# EAGLE design RasPi-BplusHAT (EAGLE 7.3.0)
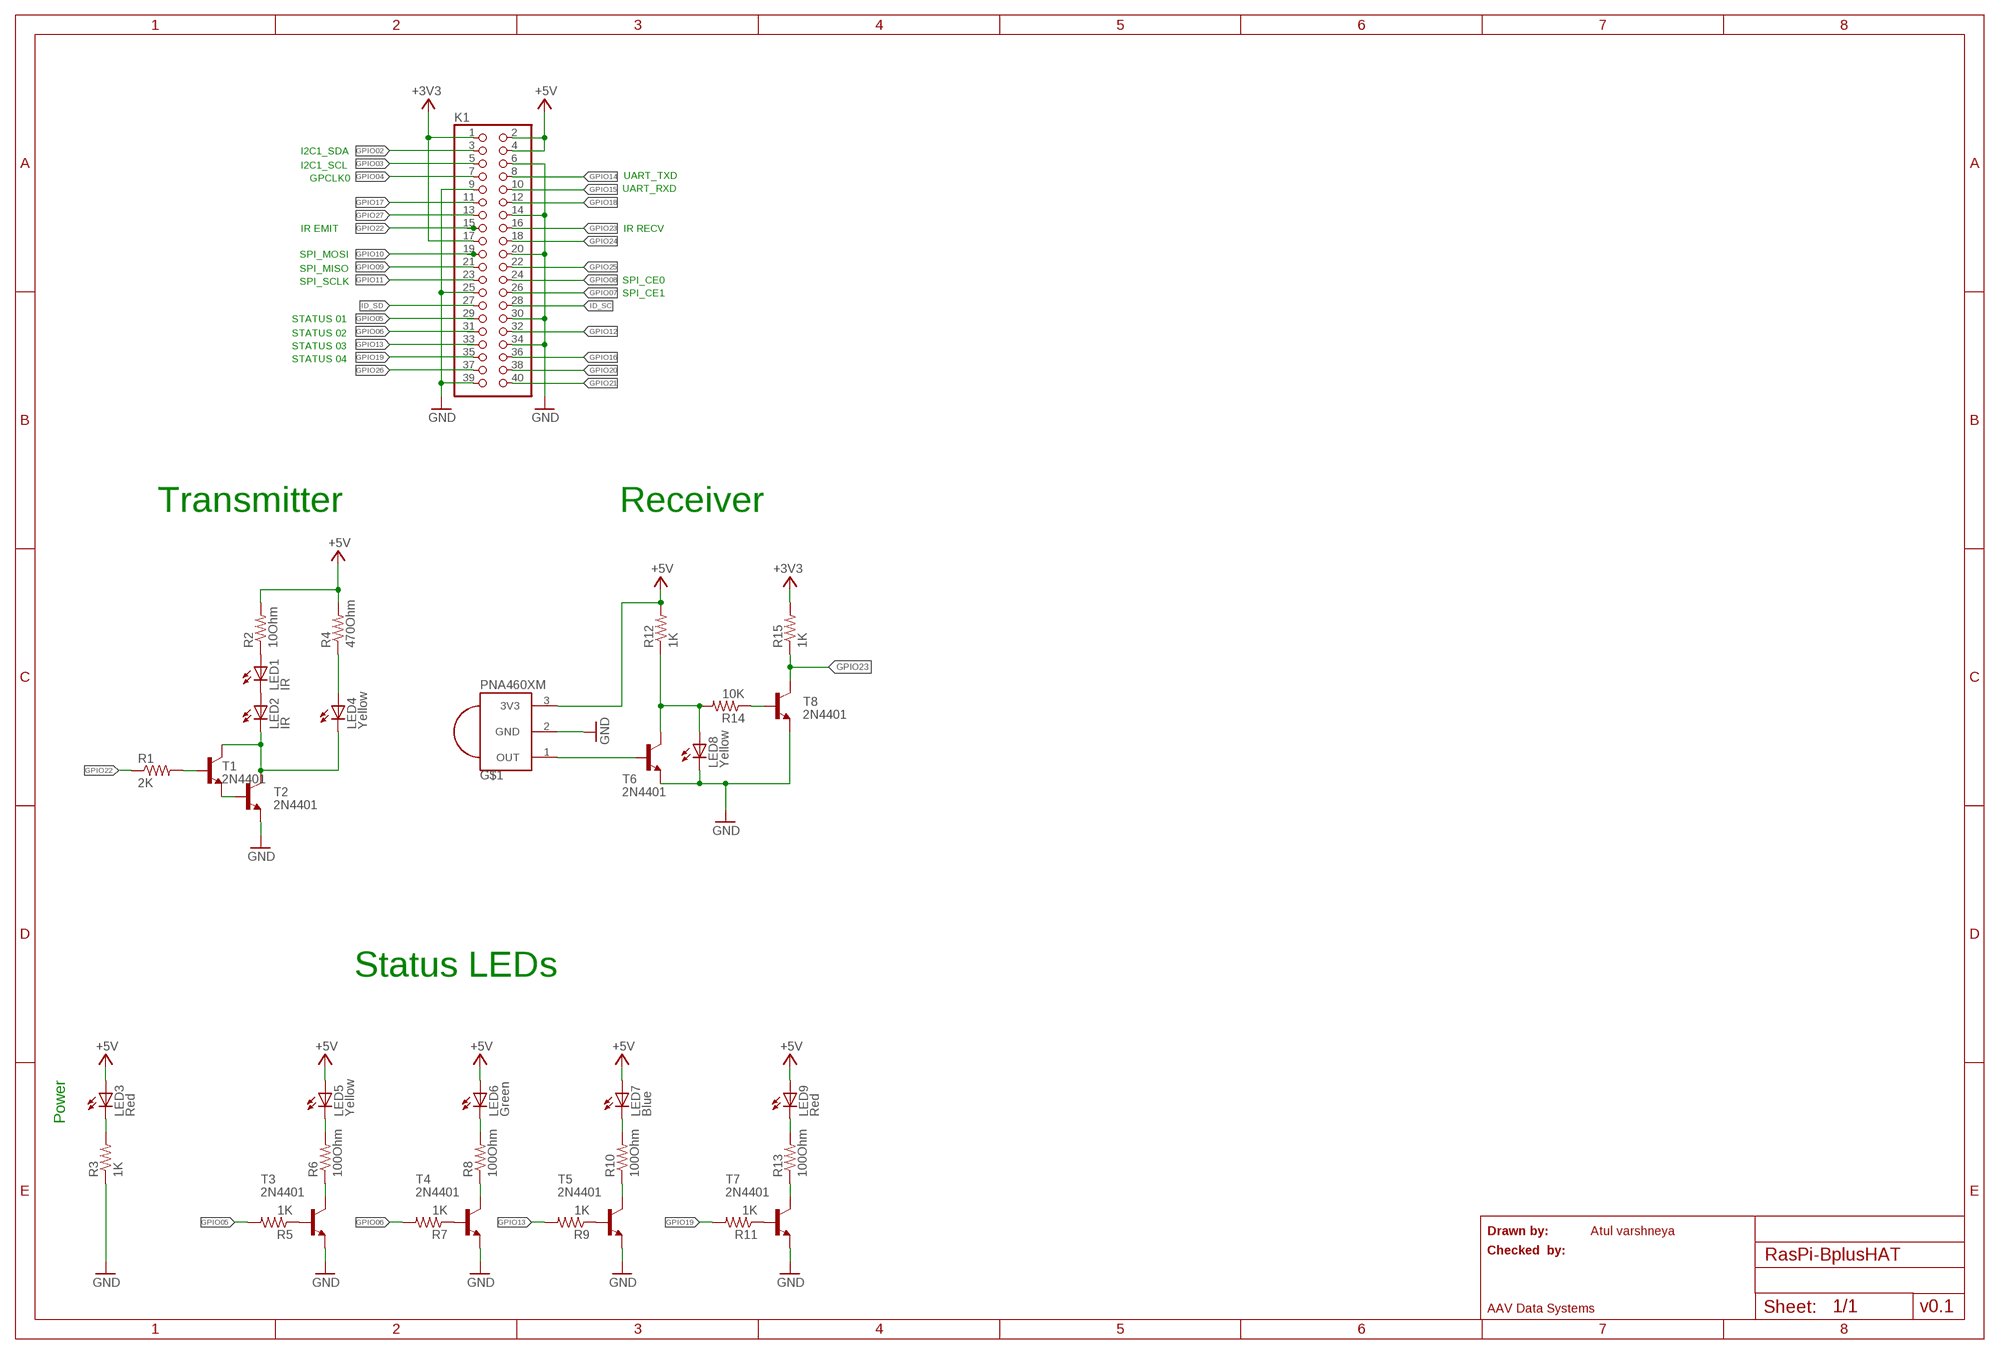
[diagram p0: schematic, sheet 1]

## Parts
G$1  PNA460XM  [PNA460XM]
K1  PINHD-2X20  [2X20]
LED1  IR  LEDMICRO-SIDELED  [MICRO-SIDELED]
LED2  IR  LEDMICRO-SIDELED  [MICRO-SIDELED]
LED3  Red  LEDCHIPLED_0805  [CHIPLED_0805]
LED4  Yellow  LEDCHIPLED_0805  [CHIPLED_0805]
LED5  Yellow  LEDCHIPLED_0805  [CHIPLED_0805]
LED6  Green  LEDCHIPLED_0805  [CHIPLED_0805]
LED7  Blue  LEDCHIPLED_0805  [CHIPLED_0805]
LED8  Yellow  LEDCHIPLED_0805  [CHIPLED_0805]
LED9  Red  LEDCHIPLED_0805  [CHIPLED_0805]
R1  2K  R-US_R0805  [R0805]
R2  10Ohm  R-US_R0805  [R0805]
R3  1K  R-US_R0805  [R0805]
R4  470Ohm  R-US_R0805  [R0805]
R5  1K  R-US_R0805  [R0805]
R6  100Ohm  R-US_R0805  [R0805]
R7  1K  R-US_R0805  [R0805]
R8  100Ohm  R-US_R0805  [R0805]
R9  1K  R-US_R0805  [R0805]
R10  100Ohm  R-US_R0805  [R0805]
R11  1K  R-US_R0805  [R0805]
R12  1K  R-US_R0805  [R0805]
R13  100Ohm  R-US_R0805  [R0805]
R14  10K  R-US_R0805  [R0805]
R15  1K  R-US_R0805  [R0805]
T1  2N4401  MMBT4401LT1-NPN-SOT23-BEC  [SOT23-BEC]
T2  2N4401  MMBT4401LT1-NPN-SOT23-BEC  [SOT23-BEC]
T3  2N4401  MMBT4401LT1-NPN-SOT23-BEC  [SOT23-BEC]
T4  2N4401  MMBT4401LT1-NPN-SOT23-BEC  [SOT23-BEC]
T5  2N4401  MMBT4401LT1-NPN-SOT23-BEC  [SOT23-BEC]
T6  2N4401  MMBT4401LT1-NPN-SOT23-BEC  [SOT23-BEC]
T7  2N4401  MMBT4401LT1-NPN-SOT23-BEC  [SOT23-BEC]
T8  2N4401  MMBT4401LT1-NPN-SOT23-BEC  [SOT23-BEC]

## Nets
+3V3: K1.1 K1.17 R15.2
+5V: G$1.3(3V3) K1.2 K1.4 LED3.A LED5.A LED6.A LED7.A LED9.A R2.2 R4.2 R12.2
GND: G$1.2(GND) K1.6 K1.9 K1.14 K1.20 K1.25 K1.30 K1.34 K1.39 LED8.C R3.1 T2.E T3.E T4.E T5.E T6.E T7.E T8.E
GPIO02: K1.3
GPIO03: K1.5
GPIO04: K1.7
GPIO05: K1.29 R5.2
GPIO06: K1.31 R7.2
GPIO07: K1.26
GPIO08: K1.24
GPIO09: K1.21
GPIO10: K1.19
GPIO11: K1.23
GPIO12: K1.32
GPIO13: K1.33 R9.2
GPIO14: K1.8
GPIO15: K1.10
GPIO16: K1.36
GPIO17: K1.11
GPIO18: K1.12
GPIO19: K1.35 R11.2
GPIO20: K1.38
GPIO21: K1.40
GPIO22: K1.15 R1.1
GPIO23: K1.16 R15.1 T8.C
GPIO24: K1.18
GPIO25: K1.22
GPIO26: K1.37
GPIO27: K1.13
ID_SC: K1.28
ID_SD: K1.27
N$1: R6.1 T3.C
N$2: LED1.A R2.1
N$3: LED1.C LED2.A
N$4: LED2.C LED4.C T1.C T2.C
N$5: R1.2 T1.B
N$6: LED4.A R4.1
N$7: LED5.C R6.2
N$8: G$1.1(OUT) T6.B
N$9: R5.1 T3.B
N$10: LED8.A R12.1 R14.2 T6.C
N$11: T1.E T2.B
N$12: R8.1 T4.C
N$13: R10.1 T5.C
N$14: LED9.C R13.2
N$15: R13.1 T7.C
N$16: LED7.C R10.2
N$17: LED6.C R8.2
N$18: R7.1 T4.B
N$19: R9.1 T5.B
N$20: R11.1 T7.B
N$21: LED3.C R3.2
N$23: R14.1 T8.B

## Notes on the sheet
- I2C1_SDA
- I2C1_SCL
- GPCLK0 | UART_TXD
- UART_RXD
- IR EMIT | IR RECV
- SPI_MOSI
- SPI_MISO
- SPI_SCLK | SPI_CE0
- SPI_CE1
- STATUS 01
- STATUS 02
- STATUS 03
- STATUS 04
- Receiver
- Transmitter
- Status LEDs
- Power
- Drawn by: | Atul varshneya
- Checked  by:
- AAV Data Systems | v0.1

## Library data of the parts
G$1 = adafruit:PNA460XM: IR 38KHz receiver PNA4602 and related receivers http://www.ladyada.net/library/pcb/eaglelibrary.html; MPN: TSDP34138; OC_NEWARK: 68X1938
K1 = adafruit:PINHD-2X20: PIN HEADER; OC_NEWARK: unknown
LED1 LED2 = led:LED: LED; MPN: VSMB10940X01; OC_NEWARK: 64X9433
LED3 LED9 = adafruit:LED: LED; MPN: 150080RS75000; OC_NEWARK: 95W3801
LED4 LED5 LED8 = adafruit:LED: LED; MPN: 150080YS75000; OC_NEWARK: 95W3804
LED6 = adafruit:LED: LED; MPN: 150080GS75000; OC_NEWARK: 95W3800
LED7 = adafruit:LED: LED; MPN: 150080BS75000; OC_NEWARK: 95W3799
R1 = adafruit:R-US_: RESISTOR, American symbol; MPN: CRCW08052K00JNEA; OC_NEWARK: 59M6864
R2 = adafruit:R-US_: RESISTOR, American symbol; MF: OUTSOURCE ITEM; MPN: RP2012S-100-F; OC_NEWARK: 28K1497
R3 R5 R7 R9 R11 R12 R15 = rcl:R-US_: RESISTOR, American symbol; MF: VISHAY/DALE; MPN: CRCW08051K00JNEA; OC_NEWARK: 52K9725
R4 = adafruit:R-US_: RESISTOR, American symbol; MPN: CRCW0805470RJNEA; OC_NEWARK: 59M8584
R6 R8 R10 R13 = rcl:R-US_: RESISTOR, American symbol; MPN: CRCW0805100RJNTA; OC_NEWARK: 57K6355
R14 = rcl:R-US_: RESISTOR, American symbol; MF: VISHAY/DALE; MPN: CRCW080510K0JNEB; OC_NEWARK: 65J1362
T1 T2 = transistor-neu-to92:*-NPN-: NPN Transistror BF959 corrected 2008.03.06; MPN: MMBT4401-TP; OC_NEWARK: 51T4931
T3-T8 = transistor:*-NPN-: NPN Transistror BF959 corrected 2008.03.06; MPN: MMBT4401-TP; OC_NEWARK: 51T4931

## Board
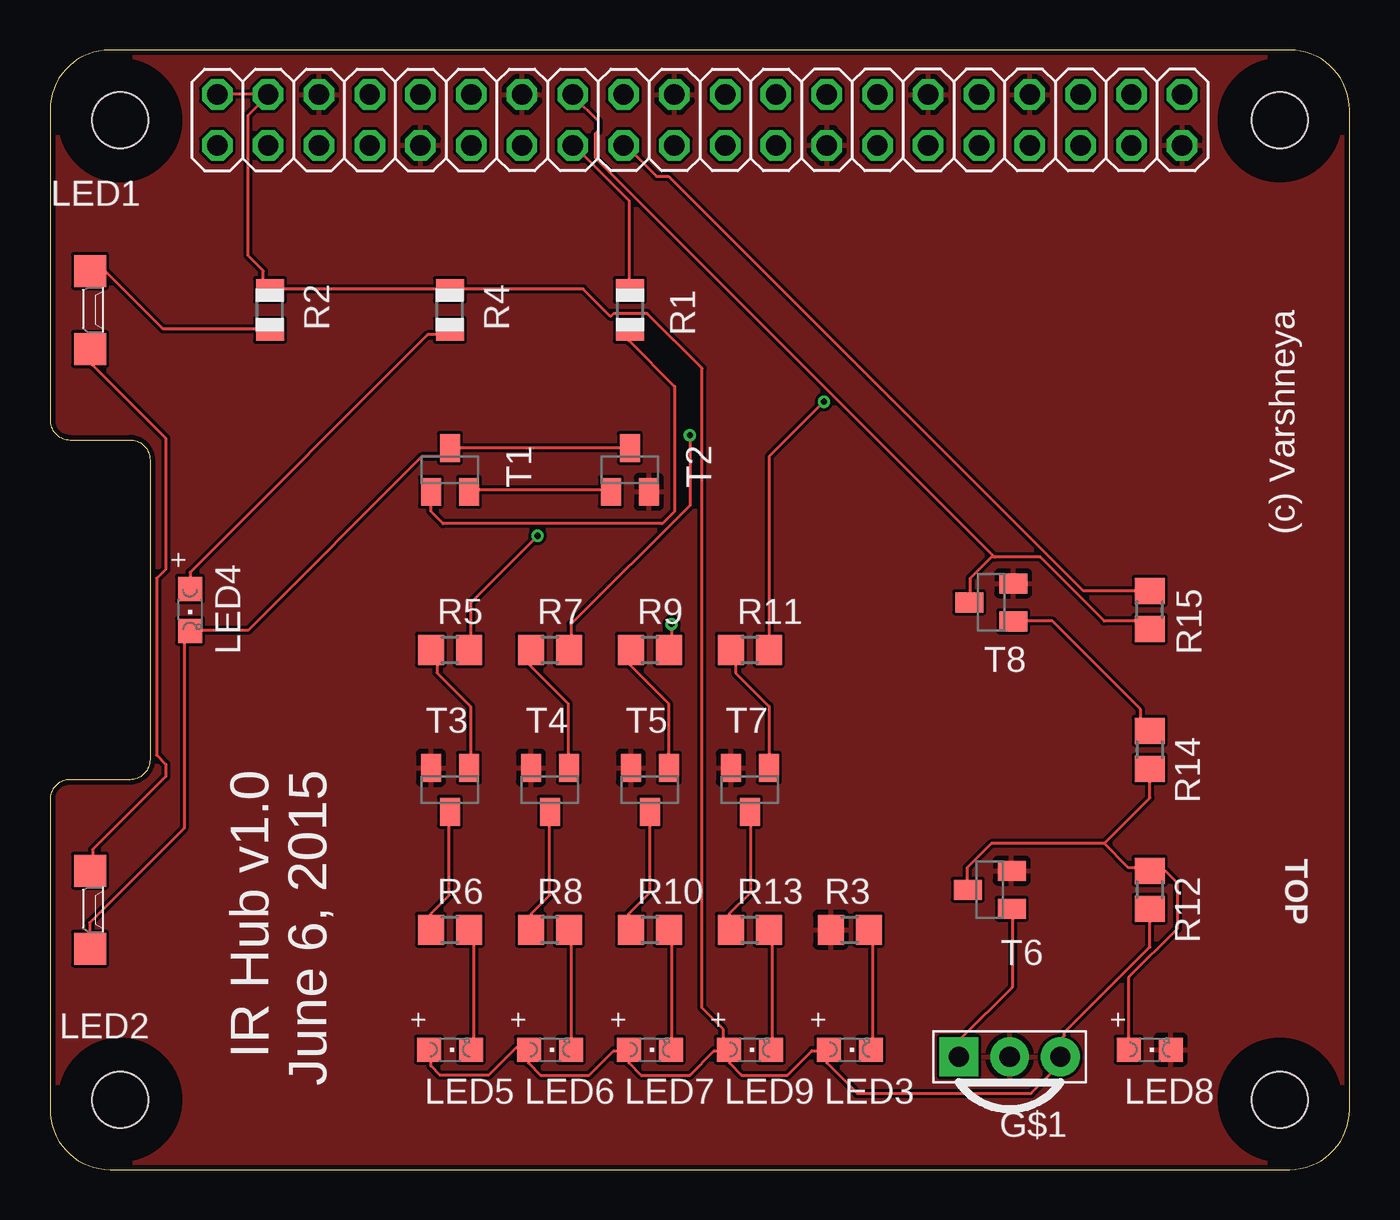
[diagram p1: board, top side]
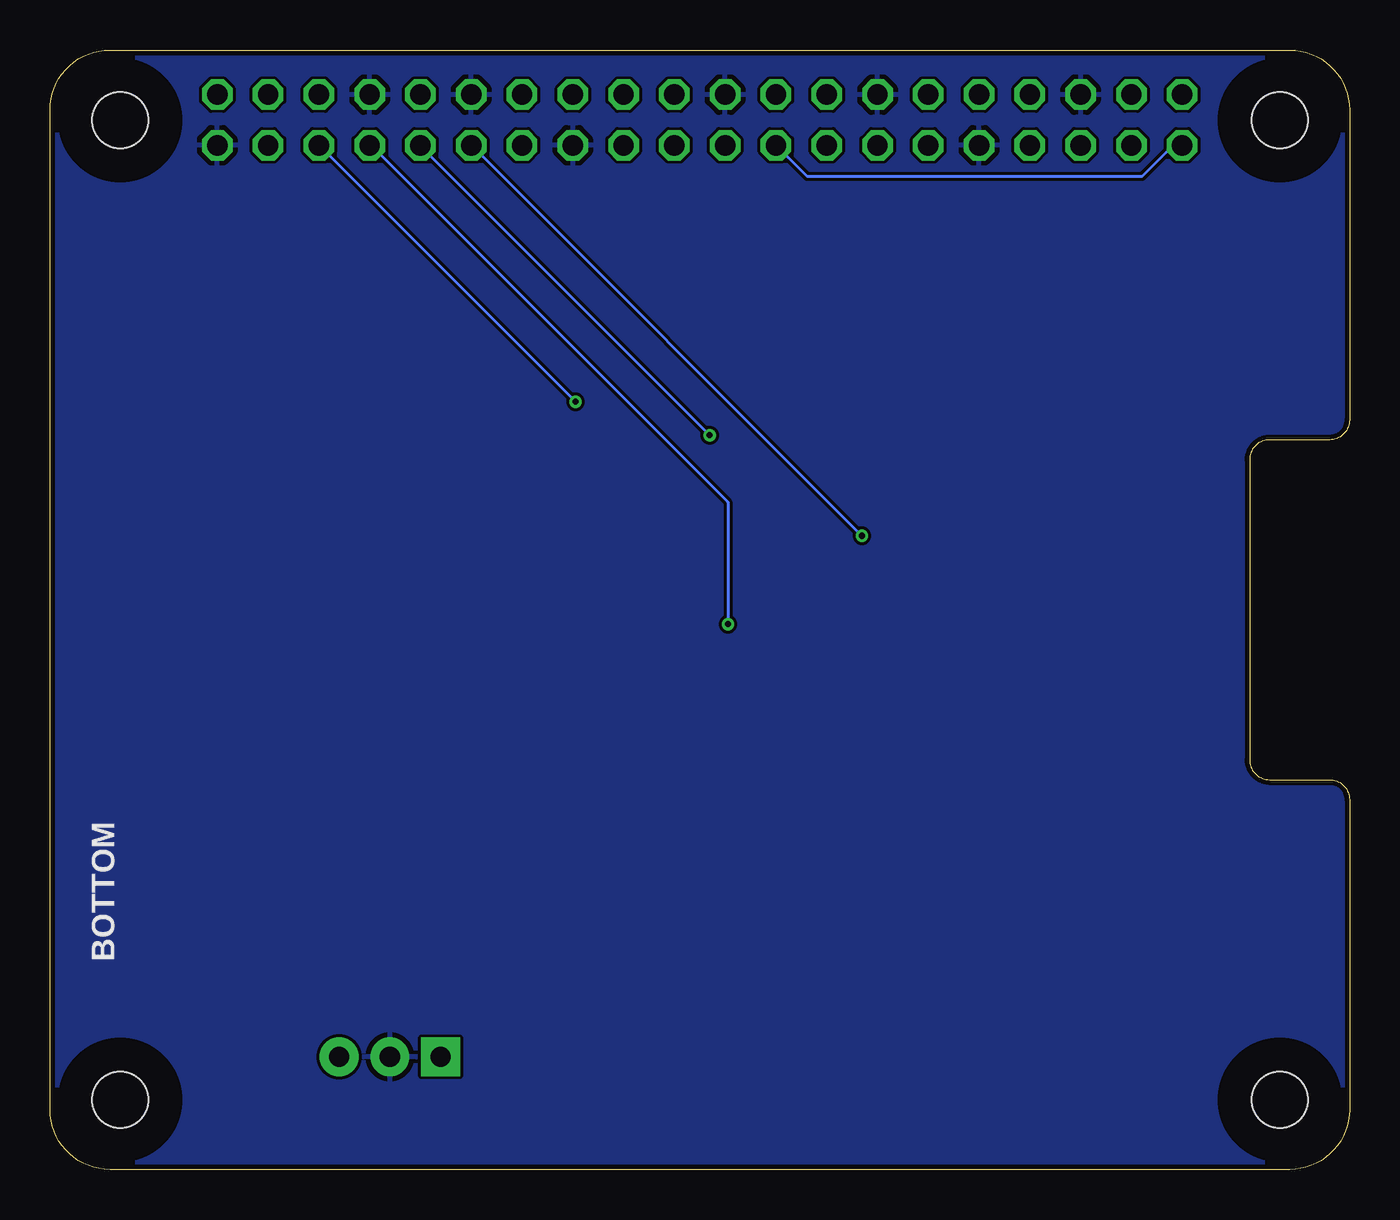
[diagram p2: board, bottom side, seen from below]

Size 65 x 56 mm. Coordinates in mm from the lower left corner, seen from the top.
Outline: 0,3 arc90 3,0 62,0 arc90 65,3 65,53 arc90 62,56 3,56 arc90 0,53 0,37.5 arc90 1,36.5 4,36.5 arc-90 5,35.5 5,20.5 arc-90 4,19.5 1,19.5 arc90 0,18.5 0,3
Copper layers (1*16): Top 0.035mm / dielectric 1.5mm / Bottom 0.035mm
Design rules "ITEADstudio_DRC": minimum track width 6mil, minimum drill 12mil, track to track 6mil, track to pad 6mil, pad to pad 6mil, via to via 6mil, smd to smd 0mil, copper to edge 10mil, drill to drill 10mil, minimum pad ring 10mil, minimum via ring 6mil, stop-mask expansion 2mil, vias tented up to drill 100mil, thermal gap 10mil
Holes 2.8 mm at 3.5,3.5 3.5,52.5 61.5,52.5 61.5,3.5
tRestrict: area 1.9,51 to 5,54; area 60,51 to 63,54; area 60,1.9 to 63,5; area 1.9,1.9 to 5,5
bRestrict: area 1.9,1.9 to 5,5; area 1.9,51 to 5,54; area 60,1.9 to 63,5; area 60,51 to 63,54

### Footprints (pad centres in the part's own frame; a part is rotated, then mirrored left to right if it is on the bottom)
PNA460XM = drill 1.016 pad 1.93 square: 1 -2.54,0 | drill 1.016 pad 1.93: 2 0,0; 3 2.54,0
2X20 = drill 1.016 octagon: 1 -24.13,-1.27; 2 -24.13,1.27; 3 -21.59,-1.27; 4 -21.59,1.27; 5 -19.05,-1.27; 6 -19.05,1.27; 7 -16.51,-1.27; 8 -16.51,1.27; 9 -13.97,-1.27; 10 -13.97,1.27; 11 -11.43,-1.27; 12 -11.43,1.27; 13 -8.89,-1.27; 14 -8.89,1.27; 15 -6.35,-1.27; 16 -6.35,1.27; 17 -3.81,-1.27; 18 -3.81,1.27; 19 -1.27,-1.27; 20 -1.27,1.27; 21 1.27,-1.27; 22 1.27,1.27; 23 3.81,-1.27; 24 3.81,1.27; 25 6.35,-1.27; 26 6.35,1.27; 27 8.89,-1.27; 28 8.89,1.27; 29 11.43,-1.27; 30 11.43,1.27; 31 13.97,-1.27; 32 13.97,1.27; 33 16.51,-1.27; 34 16.51,1.27; 35 19.05,-1.27; 36 19.05,1.27; 37 21.59,-1.27; 38 21.59,1.27; 39 24.13,-1.27; 40 24.13,1.27
MICRO-SIDELED = smd 1.6 x 1.6: A 0,1.95; C 0,-1.95
CHIPLED_0805 = smd 1.2 x 1.2: A 0,-1.05; C 0,1.05
R0805 = smd 1.1 x 1.4: 1 -1,0; 2 1,0
R0805' = smd 1.3 x 1.5: 1 -0.95,0; 2 0.95,0
SOT23-BEC = smd 1 x 1.4: B -0.95,-1.1; C 0,1.1; E 0.95,-1.1

### Placement (x,y rotation side)
G$1  48,5.63 0 top
K1  32.5,52.5 0 top
LED1  2,43 0 top
LED2  2,13 0 top
LED3  40,6 270 top
LED4  7,28 180 top
LED5  20,6 270 top
LED6  25,6 270 top
LED7  30,6 270 top
LED8  55,6 270 top
LED9  35,6 270 top
R1  29,43 270 top
R2  11,43 90 top
R3  1K  [R0805']  40,12 0 top
R4  20,43 90 top
R5  1K  [R0805']  20,26 0 top
R6  100Ohm  [R0805']  20,12 0 top
R7  1K  [R0805']  25,26 0 top
R8  100Ohm  [R0805']  25,12 0 top
R9  1K  [R0805']  30,26 0 top
R10  100Ohm  [R0805']  30,12 0 top
R11  1K  [R0805']  35,26 0 top
R12  1K  [R0805']  55,14 270 top
R13  100Ohm  [R0805']  35,12 0 top
R14  10K  [R0805']  55,21 270 top
R15  1K  [R0805']  55,28 90 top
T1  20,35 0 top
T2  29,35 0 top
T3  20,19 180 top
T4  25,19 180 top
T5  30,19 180 top
T6  47,14 90 top
T7  35,19 180 top
T8  47.08,28.38 90 top

### Tracks (layer width: path | path; a pad name or v marks a point on that pad's centre or on a via)
+3V3
  Top 0.152: R15.2 54.86,28.96 51.66,28.96 30.94,49.68 30.33,49.68 28.8,51.21 K1.17
  Bottom 0.152: K1.1 8.38,51.21 8.84,51.21 10.36,49.68 27.13,49.68 28.65,51.21 K1.17
+5V
  Top 0.152: K1.2 8.38,53.8 10.82,53.8 K1.4 10.82,53.65 9.91,52.73 9.91,45.72 10.67,44.96 10.67,44.35 10.97,44.04 R2.2 11.12,44.04 19.96,44.04 R4.2 20.12,44.04 26.67,44.04 28.04,42.67 28.19,42.82 29.87,42.82 32.61,40.08 32.61,8.08 33.68,7.01 33.68,5.94 | R12.2 55.02,12.95 55.02,11.12 50.75,6.86 50.75,6.71 50.6,6.55 50.6,5.64 G$1.3 50.44,5.49 50.44,5.18 49.07,3.81 40.39,3.81 38.86,5.33 38.86,5.94 | LED5.A 19.05,5.94 19.05,5.18 19.51,4.72 21.95,4.72 23.32,6.1 23.93,6.1 LED6.A 23.93,5.94 23.93,5.33 24.54,4.72 26.98,4.72 28.19,5.94 28.8,5.94 LED7.A 28.96,5.94 28.96,5.33 29.57,4.72 32,4.72 33.22,5.94 33.68,5.94 | 33.68,5.94 33.83,5.94 LED9.A | 38.86,5.94 38.1,5.94 36.88,4.72 34.59,4.72 33.98,5.33 33.98,5.94 LED9.A | 38.86,5.94 LED3.A | 33.68,5.94 LED9.A
GND
  pour Bottom: 0,3 arc90 3,0 62,0 arc90 65,3 65,53 arc90 62,56 3,56 arc90 0,53 0,37.5 arc90 1,36.5 4,36.5 arc-90 5,35.5 5,20.5 arc-90 4,19.5 1,19.5 arc90 0,18.5
  pour Top: 0,3 arc90 3,0 62,0 arc90 65,3 65,53 arc90 62,56 3,56 arc90 0,53 0,37.5 arc90 1,36.5 4,36.5 arc-90 5,35.5 5,20.5 arc-90 4,19.5 1,19.5 arc90 0,18.5
GPIO05  (via drill 0.3)
  Top 0.152: v24.38,31.7 21.03,28.35 21.03,26.06 R5.2
  Bottom 0.152: v24.38,31.7 43.89,51.21 K1.29
GPIO06  (via drill 0.3)
  Top 0.152: v32,36.73 32,33.22 26.06,27.28 26.06,26.06 R7.2
  Bottom 0.152: v32,36.73 46.48,51.21 K1.31
GPIO13  (via drill 0.3)
  Top 0.152: v31.09,27.28 31.09,26.06 R9.2
  Bottom 0.152: v31.09,27.28 31.09,33.38 48.92,51.21 K1.33
GPIO19  (via drill 0.3)
  Top 0.152: v38.71,38.41 35.97,35.66 35.97,26.06 R11.2
  Bottom 0.152: v38.71,38.41 51.51,51.21 K1.35
GPIO22
  Top 0.152: R1.1 28.96,44.04 28.96,48.46 26.21,51.21 K1.15
GPIO23
  Top 0.152: 47.24,30.63 49.53,30.63 52.73,27.43 54.56,27.43 54.86,27.13 R15.1 | 47.24,30.63 47.09,30.63 46.02,29.57 46.02,28.5 T8.C | 47.24,30.63 27.28,50.6 27.28,51.82 27.43,51.97 27.43,52.43 26.21,53.65 K1.16
N$1
  Top 0.152: R6.1 19.05,12.8 19.96,13.72 19.96,17.83 T3.C
N$2
  Top 0.152: R2.1 10.97,42.06 5.64,42.06 2.74,44.96 2.13,44.96 LED1.A
N$3
  Top 0.152: LED2.A 2.13,15.09 2.13,16 5.79,19.66 5.79,20.27 5.33,20.73 5.33,29.57 5.79,30.02 5.79,36.58 2.13,40.23 2.13,41 LED1.C
N$4
  Top 0.152: T2.C 28.96,36.12 20.12,36.12 T1.C 19.96,35.97 19.66,35.66 18.59,35.66 9.91,26.98 7.01,26.98 LED4.C 6.86,26.82 6.71,26.67 6.71,17.07 1.98,12.34 1.98,11.12 LED2.C
N$5
  Top 0.152: T1.B 19.05,32.92 19.66,32.31 30.63,32.31 31.24,32.92 31.24,39.17 28.96,41.45 28.96,41.91 R1.2
N$6
  Top 0.152: LED4.A 7.01,29.11 7.01,29.87 18.9,41.76 19.81,41.76 19.96,41.91 R4.1
N$7
  Top 0.152: LED5.C 21.18,6.1 21.18,11.73 21.03,11.89 R6.2
N$8
  Top 0.152: T6.B 48.16,12.95 48.16,9.14 45.57,6.55 45.57,5.64 G$1.1
N$9
  Top 0.152: T3.B 21.03,20.12 21.03,23.16 19.36,24.84 19.36,25.6 19.05,25.91 R5.1
N$10
  Top 0.152: LED8.A 53.95,6.1 53.95,9.6 56.39,12.04 56.39,14.33 55.78,14.94 55.02,14.94 R12.1 54.86,15.09 53.95,15.09 52.73,16.31 | 52.73,16.31 47.09,16.31 45.87,15.09 45.87,14.02 T6.C | 52.73,16.31 55.02,18.59 55.02,19.96 R14.2
N$11
  Top 0.152: T1.E 21.03,33.98 28.04,33.98 T2.B
N$12
  Top 0.152: T4.C 24.99,17.83 24.99,13.72 24.08,12.8 24.08,12.04 R8.1
N$13
  Top 0.152: T5.C 30.02,17.83 30.02,13.87 28.96,12.8 28.96,12.04 R10.1
N$14
  Top 0.152: LED9.C 36.12,6.1 36.12,11.73 35.97,11.89 R13.2
N$15
  Top 0.152: T7.C 35.05,17.83 35.05,13.87 33.98,12.8 33.98,12.04 R13.1
N$16
  Top 0.152: LED7.C 31.09,6.1 31.09,11.89 R10.2
N$17
  Top 0.152: LED6.C 26.06,6.1 26.06,11.89 R8.2
N$18
  Top 0.152: T4.B 25.91,20.12 25.91,23.32 23.93,25.3 23.93,25.91 R7.1
N$19
  Top 0.152: T5.B 30.94,20.12 30.94,23.32 28.96,25.3 28.96,25.91 R9.1
N$20
  Top 0.152: T7.B 35.97,20.12 35.97,23.16 34.29,24.84 34.29,25.76 34.14,25.91 R11.1
N$21
  Top 0.152: LED3.C 41.15,6.1 41.15,11.73 41,11.89 R3.2
N$23
  Top 0.152: T8.B 48.31,27.43 50.14,27.43 54.56,23.01 54.56,22.4 54.86,22.1 R14.1

### Text on the board
tNames: (c) Varshneya | + | IR Hub v1.0 / June 6, 2015 | TOP | + | + | + | + | + | +
bNames: BOTTOM